# Altium schematic sheet 90、基于51单片机倒计时器秒表4位数码管显示设计_店主博士毕业.SchDoc
size A4
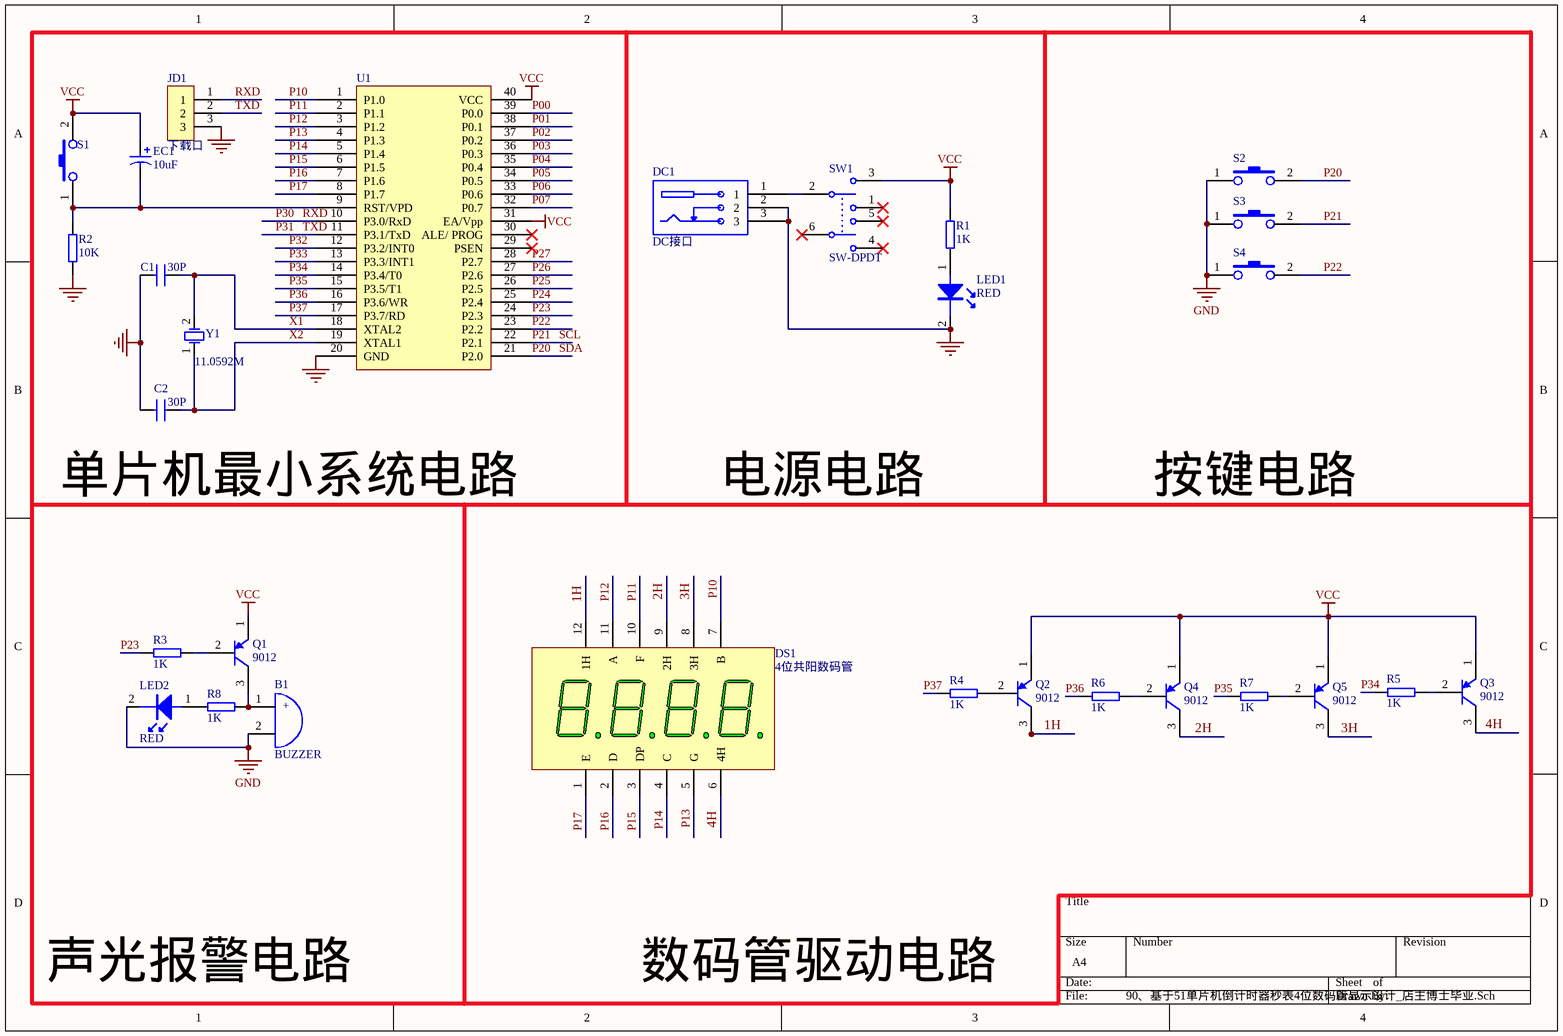
[diagram p0: 90、基于51单片机倒计时器秒表4位数码管显示设计_店主博士毕业.SchDoc]

## Parts
B1  BUZZER  [BUZZERSOT_PLASTIC]
C1  30P  [RAD-0.1]
C2  30P  [RAD-0.1]
DC1  DC接口  [DC-JACK-002]
DS1  4位共阳数码管  [SEG3641]
EC1  10uF  [RB.1/.2]
JD1  下载口  [下载串口]
LED1  RED  [LED_D3MM12]
LED2  RED  [LED_D3MM12]
Q1  9012  [TO-92]
Q2  9012  [TO-92]
Q3  9012  [TO-92]
Q4  9012  [TO-92]
Q5  9012  [TO-92]
R1  1K  [AXIAL0.3]
R2  10K  [AXIAL0.3]
R3  1K  [AXIAL0.3]
R4  1K  [AXIAL0.3]
R5  1K  [AXIAL0.3]
R6  1K  [AXIAL0.3]
R7  1K  [AXIAL0.3]
R8  1K  [AXIAL0.3]
S1  BUTTOM  [BUTTOM_6x6DIP]  (value not drawn)
S2  BUTTOM  [BUTTOM_6x6DIP]  (value not drawn)
S3  BUTTOM  [BUTTOM_6x6DIP]  (value not drawn)
S4  BUTTOM  [BUTTOM_6x6DIP]  (value not drawn)
SW1  SW-DPDT  [SW]
U1  STC89C52  [STC89]  (value not drawn)
Y1  11.0592M  [X_HC-49]

## Nets
GND: B1.2 C1.1 C2.1 DC1.2 DC1.3 JD1.3 LED1.2 LED2.2 R2.1 S2.1 S3.1 S4.1 U1.20(GND)
VCC: EC1.1 Q1.1(e) Q2.1(e) Q3.1(e) Q4.1(e) Q5.1(e) R1.2 S1.2 SW1.3 U1.31(EA/Vpp) U1.40(VCC)
1H: DS1.12(1H) Q2.3(c)
2H: DS1.9(2H) Q4.3(c)
3H: DS1.8(3H) Q5.3(c)
4H: DS1.6(4H) Q3.3(c)
P00: U1.39(P0.0)
P01: U1.38(P0.1)
P02: U1.37(P0.2)
P03: U1.36(P0.3)
P04: U1.35(P0.4)
P05: U1.34(P0.5)
P06: U1.33(P0.6)
P07: U1.32(P0.7)
P10: DS1.7(B) U1.1(P1.0)
P11: DS1.10(F) U1.2(P1.1)
P12: DS1.11(A) U1.3(P1.2)
P13: DS1.5(G) U1.4(P1.3)
P14: DS1.4(C) U1.5(P1.4)
P15: DS1.3(DP) U1.6(P1.5)
P16: DS1.2(D) U1.7(P1.6)
P17: DS1.1(E) U1.8(P1.7)
P20: S2.2 U1.21(P2.0)  [also labelled SDA]
P21: S3.2 U1.22(P2.1)  [also labelled SCL]
P22: S4.2 U1.23(P2.2)
P23: R3.2 U1.24(P2.3)
P24: U1.25(P2.4)
P25: U1.26(P2.5)
P26: U1.27(P2.6)
P27: U1.28(P2.7)
P30: JD1.1 U1.10(P3.0/RxD)  [also labelled RXD]
P31: JD1.2 U1.11(P3.1/TxD)  [also labelled TXD]
P32: U1.12(P3.2/INT0)
P33: U1.13(P3.3/INT1)
P34: R5.2 U1.14(P3.4/T0)
P35: R7.2 U1.15(P3.5/T1)
P36: R6.2 U1.16(P3.6/WR)
P37: R4.2 U1.17(P3.7/RD)
X1: C1.2 U1.18(XTAL2) Y1.2(OSC2)
X2: C2.2 U1.19(XTAL1) Y1.1(OSC1)
NetB1_1: B1.1 Q1.3(c) R8.2
NetDC1_1: DC1.1 SW1.2
NetEC1_2: EC1.2 R2.2 S1.1 U1.9(RST/VPD)
NetLED1_1: LED1.1 R1.1
NetLED2_1: LED2.1 R8.1
NetQ1_2: Q1.2(b) R3.1
NetQ2_2: Q2.2(b) R4.1
NetQ3_2: Q3.2(b) R5.1
NetQ4_2: Q4.2(b) R6.1
NetQ5_2: Q5.2(b) R7.1

Not connected (* = marked no-connect by the designer): SW1 1* 4* 5* 6*; U1 29(PSEN)* 30(ALE/_PROG)*

## Notes on the sheet
- (near C2) 单片机最小系统电路
- 电源电路
- 按键电路
- 声光报警电路
- 数码管驱动电路
- (in symbol BUZZER) +

## Library data of the parts
B1 = BUZZER: 蜂鸣器
C1 C2 = CAP: 无极性电容
DC1 = DC接口: DC接口（分大小）
EC1 = CAP_EC: 极性电容
JD1 = 下载口: 下载口2.54排针
LED1 LED2 = LED: LED灯
Q1-Q5 = 9012: 直插三极管
R1-R8 = RES: 电阻
S1-S4 = BUTTOM: 按键
SW1 = SW-DPDT: 电源开关; Published: 24-Mar-1999; LatestRevisionDate: 17-Jul-2002; LatestRevisionNote: Re-released for DXP Platform.; PackageReference: DPDT-6; Publisher: Altium Limited
U1 = STC51: 51单片机
Y1 = XTAL DIP: 晶振